# EAGLE schematic GD32F450 (EAGLE 9.6.2)
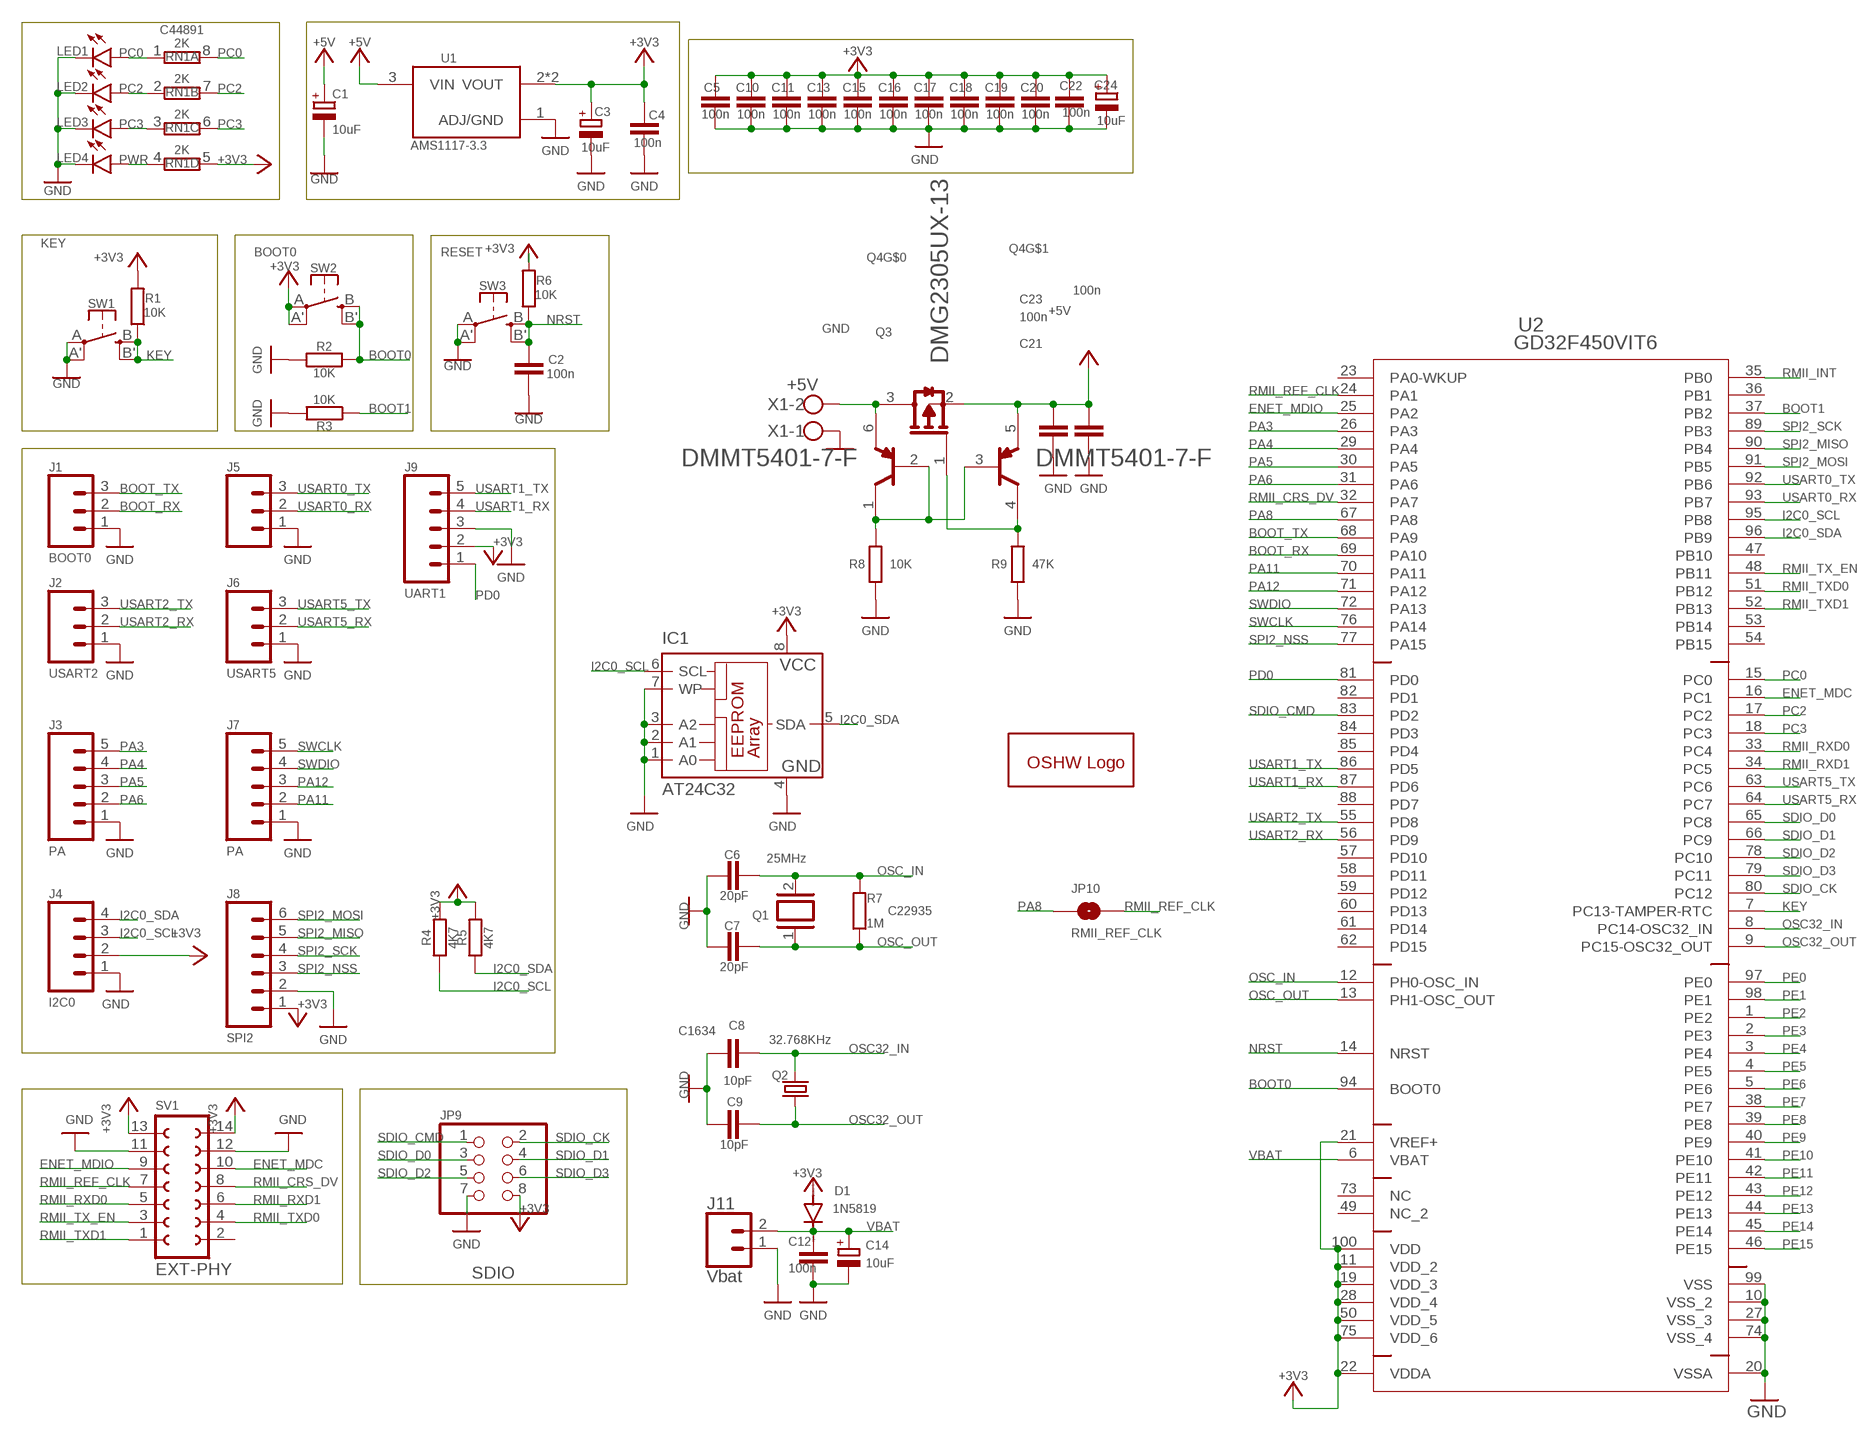
[diagram p0: schematic, sheet 1, part 1 of 2]
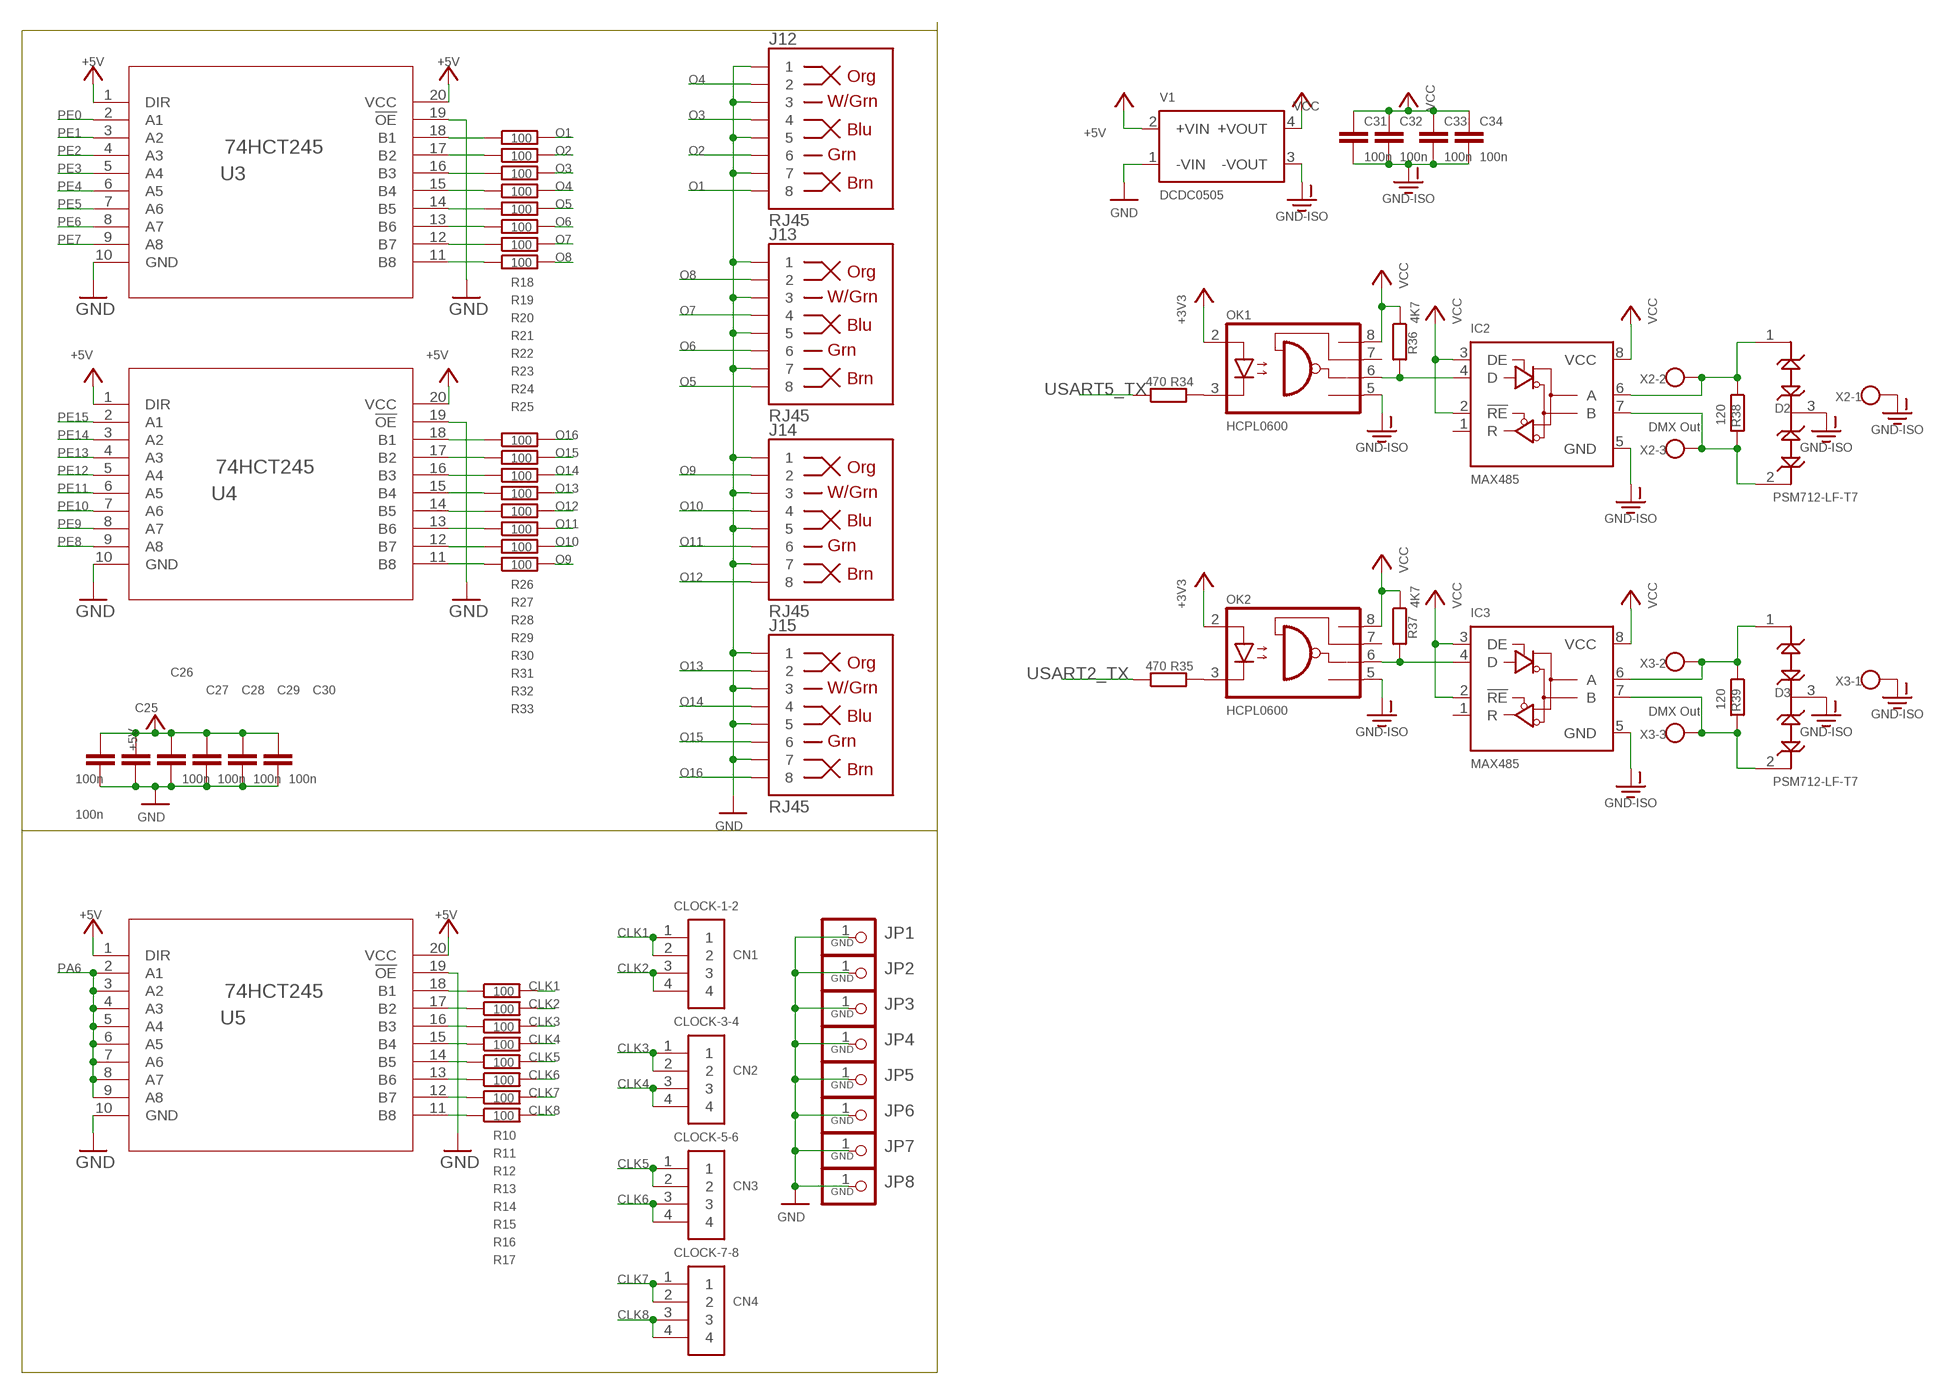
[diagram p1: schematic, sheet 1, part 2 of 2]

## Parts
C1  10uF  CPOL-EUA/3216-18R  [A/3216-18R]
C2  100n  C-EUC0603  [C0603]
C3  10uF  CPOL-EUA/3216-18R  [A/3216-18R]
C4  100n  C-EUC0603  [C0603]
C5  100n  C-EUC0603  [C0603]
C6  20pF  C-EUC0603  [C0603]
C7  20pF  C-EUC0603  [C0603]
C8  10pF  C-EUC0603  [C0603]
C9  10pF  C-EUC0603  [C0603]
C10  100n  C-EUC0603  [C0603]
C11  100n  C-EUC0603  [C0603]
C12  100n  C-EUC0603  [C0603]
C13  100n  C-EUC0603  [C0603]
C14  10uF  CPOL-EUA/3216-18R  [A/3216-18R]
C15  100n  C-EUC0603  [C0603]
C16  100n  C-EUC0603  [C0603]
C17  100n  C-EUC0603  [C0603]
C18  100n  C-EUC0603  [C0603]
C19  100n  C-EUC0603  [C0603]
C20  100n  C-EUC0603  [C0603]
C21  100n  C-EUC0603  [C0603]
C22  100n  C-EUC0603  [C0603]
C23  100n  C-EUC0603  [C0603]
C24  10uF  CPOL-EUA/3216-18R  [A/3216-18R]
C25  100n  C-EUC0603  [C0603]
C26  100n  C-EUC0603  [C0603]
C27  100n  C-EUC0603  [C0603]
C28  100n  C-EUC0603  [C0603]
C29  100n  C-EUC0603  [C0603]
C30  100n  C-EUC0603  [C0603]
C31  100n  C-EUC0603  [C0603]
C32  100n  C-EUC0603  [C0603]
C33  100n  C-EUC0603  [C0603]
C34  100n  C-EUC0603  [C0603]
CN1  CLOCK-1-2  1X4-CLEANBIG  [1X04-CLEANBIG]
CN2  CLOCK-3-4  1X4-CLEANBIG  [1X04-CLEANBIG]
CN3  CLOCK-5-6  1X4-CLEANBIG  [1X04-CLEANBIG]
CN4  CLOCK-7-8  1X4-CLEANBIG  [1X04-CLEANBIG]
D1  1N5819  DIODE-SOD323-R  [SOD323-R]
D2  PSM712-LF-T7  2CH_BI_DIR_TVSSOT23  [SOT23-3]
D3  PSM712-LF-T7  2CH_BI_DIR_TVSSOT23  [SOT23-3]
GOLD_ORB_SM1  OSHWLOGOLOGO5MM  [OSHW_5MM]
IC1  AT24C32  24C04ASM  [SO-08M]
IC2  MAX485  75176AD  [D_R-PDSO-G8]
IC3  MAX485  75176AD  [D_R-PDSO-G8]
J1  BOOT0  CONN_03  [1X03]
J2  USART2  CONN_03  [1X03]
J3  PA  CONN_05  [1X05]
J4  I2C0  CONN_04  [1X04]
J5  USART0  CONN_03  [1X03]
J6  USART5  CONN_03  [1X03]
J7  PA  CONN_05  [1X05]
J8  SPI2  CONN_06SILK_FEMALE_PTH  [1X06]
J9  UART1  CONN_05  [1X05]
J11  Vbat  CONN_021X02_NO_SILK  [1X02_NO_SILK]
J12  RJ45  RJ45-8  [RJ45-8]
J13  RJ45  RJ45-8  [RJ45-8]
J14  RJ45  RJ45-8  [RJ45-8]
J15  RJ45  RJ45-8  [RJ45-8]
JP1  GND  PINHD-1X1CB  [1X01-CLEANBIG]
JP2  GND  PINHD-1X1CB  [1X01-CLEANBIG]
JP3  GND  PINHD-1X1CB  [1X01-CLEANBIG]
JP4  GND  PINHD-1X1CB  [1X01-CLEANBIG]
JP5  GND  PINHD-1X1CB  [1X01-CLEANBIG]
JP6  GND  PINHD-1X1CB  [1X01-CLEANBIG]
JP7  GND  PINHD-1X1CB  [1X01-CLEANBIG]
JP8  GND  PINHD-1X1CB  [1X01-CLEANBIG]
JP9  SDIO  PINHD-2X4  [2X04]
JP10  RMII_REF_CLK  JUMPER-SMT_2_NO_NO-SILK  [SMT-JUMPER_2_NO_NO-SILK]
LED1  PC0  LEDCHIP-LED0603  [CHIP-LED0603]
LED2  PC2  LEDCHIP-LED0603  [CHIP-LED0603]
LED3  PC3  LEDCHIP-LED0603  [CHIP-LED0603]
LED4  PWR  LEDCHIP-LED0603  [CHIP-LED0603]
OK1  HCPL0600  [SOIC08]
OK2  HCPL0600  [SOIC08]
Q1  25MHz  XTAL/S  [QS]
Q2  32.768KHz  CRYSTALTC26H  [TC26H]
Q3  DMG2305UX  DIODES_INC._DMG2305UX-13DIODES_INC._DMG2305UX-13_0_0  [DIODES_INC._DMG2305UX-13_0]
Q4  DMMT5401  DIODES_DMMT5401-7-FDIODES_DMMT5401-7-F_0_0  [DIODES_DMMT5401-7-F_0]
R1  10K  R-EU_R0603  [R0603]
R2  10K  R-EU_R0603  [R0603]
R3  10K  R-EU_R0603  [R0603]
R4  4K7  R-EU_R0402  [R0402]
R5  4K7  R-EU_R0402  [R0402]
R6  10K  R-EU_R0603  [R0603]
R7  1M  R-EU_R0603  [R0603]
R8  10K  R-EU_R0402  [R0402]
R9  47K  R-EU_R0402  [R0402]
R10  100  R-EU_R0402  [R0402]
R11  100  R-EU_R0402  [R0402]
R12  100  R-EU_R0402  [R0402]
R13  100  R-EU_R0402  [R0402]
R14  100  R-EU_R0402  [R0402]
R15  100  R-EU_R0402  [R0402]
R16  100  R-EU_R0402  [R0402]
R17  100  R-EU_R0402  [R0402]
R18  100  R-EU_R0402  [R0402]
R19  100  R-EU_R0402  [R0402]
R20  100  R-EU_R0402  [R0402]
R21  100  R-EU_R0402  [R0402]
R22  100  R-EU_R0402  [R0402]
R23  100  R-EU_R0402  [R0402]
R24  100  R-EU_R0402  [R0402]
R25  100  R-EU_R0402  [R0402]
R26  100  R-EU_R0402  [R0402]
R27  100  R-EU_R0402  [R0402]
R28  100  R-EU_R0402  [R0402]
R29  100  R-EU_R0402  [R0402]
R30  100  R-EU_R0402  [R0402]
R31  100  R-EU_R0402  [R0402]
R32  100  R-EU_R0402  [R0402]
R33  100  R-EU_R0402  [R0402]
R34  470  R-EU_R0402  [R0402]
R35  470  R-EU_R0402  [R0402]
R36  4K7  R-EU_R0402  [R0402]
R37  4K7  R-EU_R0402  [R0402]
R38  120  R-EU_R0402  [R0402]
R39  120  R-EU_R0402  [R0402]
RN1  2K  4R-N0402ARV341  [4X0402ARV341]
SV1  EXT-PHY  FE07-2W  [FE07-2W]
SW1  KEY  SPST_TACT-EVQQ2  [EVQ-Q2]
SW2  BOOT0  SPST_TACT-EVQQ2  [EVQ-Q2]
SW3  RESET  SPST_TACT-EVQQ2  [EVQ-Q2]
U1  AMS1117-3.3  [SOT229P700X180-4N]
U2  GD32F450VIT6  GD32F450VET6  [LQFP100]
U3  74HCT245  SN74HCT245PWR  [PW20]
U4  74HCT245  SN74HCT245PWR  [PW20]
U5  74HCT245  SN74HCT245PWR  [PW20]
V1  DCDC0505  TME0505S  [TME]
X1  +5V  W237-102  [W237-102]
X2  DMX Out  W237-103  [W237-103]
X3  DMX Out  W237-103  [W237-103]

## Nets
+3V3: C3.+ C4.1 C5.1 C10.1 C11.1 C13.1 C15.1 C16.1 C17.1 C18.1 C19.1 C20.1 C22.1 C24.+ D1.A IC1.8(VCC) J4.2 J8.1 J9.2 JP9.8 OK1.2(A) OK2.2(A) R1.2 R4.2 R5.2 R6.2 RN1.5 SV1.13 SV1.14 SW2.A'(P1) SW2.A(P) U1.2(VOUT) U1.4(VOUT) U2.11(VDD_2) U2.19(VDD_3) U2.21(VREF+) U2.22(VDDA) U2.28(VDD_4) U2.50(VDD_5) U2.75(VDD_6) U2.100(VDD)
+5V: C1.+ C21.1 C23.1 C25.1 C26.1 C27.1 C28.1 C29.1 C30.1 Q3.2(S) Q4.5(E2) U1.3(VIN) U3.1(DIR) U3.20(VCC) U4.1(DIR) U4.20(VCC) U5.1(DIR) U5.20(VCC) V1.2(+VIN)
BOOT0: R2.2 SW2.B'(S1) SW2.B(S) U2.94(BOOT0)
BOOT1: R3.1 U2.37(PB2)
BOOT_RX: J1.2 U2.69(PA10)
BOOT_TX: J1.3 U2.68(PA9)
CLK1: CN1.1 CN1.2 R10.2
CLK2: CN1.3 CN1.4 R11.2
CLK3: CN2.1 CN2.2 R12.2
CLK4: CN2.3 CN2.4 R13.2
CLK5: CN3.1 CN3.2 R14.2
CLK6: CN3.3 CN3.4 R15.2
CLK7: CN4.1 CN4.2 R16.2
CLK8: CN4.3 CN4.4 R17.2
ENET_MDC: SV1.10 U2.16(PC1)
ENET_MDIO: SV1.9 U2.25(PA2)
GND: C1.- C2.2 C3.- C4.2 C5.2 C6.1 C7.1 C8.1 C9.1 C10.2 C11.2 C12.2 C13.2 C14.- C15.2 C16.2 C17.2 C18.2 C19.2 C20.2 C21.2 C22.2 C23.2 C24.- C25.2 C26.2 C27.2 C28.2 C29.2 C30.2 IC1.1(A0) IC1.2(A1) IC1.3(A2) IC1.4(GND) IC1.7(WP) J1.1 J2.1 J3.1 J4.1 J5.1 J6.1 J7.1 J8.2 J9.3 J11.1 J12.1 J12.3 J12.5 J12.7 J13.1 J13.3 J13.5 J13.7 J14.1 J14.3 J14.5 J14.7 J15.1 J15.3 J15.5 J15.7 JP1.1 JP2.1 JP3.1 JP4.1 JP5.1 JP6.1 JP7.1 JP8.1 JP9.7 LED1.C LED2.C LED3.C LED4.C R2.1 R3.2 R8.1 R9.1 SV1.11 SV1.12 SW1.A'(P1) SW1.A(P) SW3.A'(P1) SW3.A(P) U1.1(ADJ/GND) U2.10(VSS_2) U2.20(VSSA) U2.27(VSS_3) U2.74(VSS_4) U2.99(VSS) U3.10(GND) U3.19(!OE) U4.10(GND) U4.19(!OE) U5.10(GND) U5.19(!OE) V1.1(-VIN) X1.1
GND-ISO: C31.2 C32.2 C33.2 C34.2 D2.3 D3.3 IC2.5(GND) IC3.5(GND) OK1.5(GND) OK2.5(GND) V1.3(-VOUT) X2.1 X3.1
I2C0_SCL: IC1.6(SCL) J4.3 R4.1 U2.95(PB8)
I2C0_SDA: IC1.5(SDA) J4.4 R5.1 U2.96(PB9)
KEY: R1.1 SW1.B'(S1) SW1.B(S) U2.7(PC13-TAMPER-RTC)
N$1: R18.1 U3.18(B1)
N$2: Q4.1(C1) Q4.2(B1) Q4.3(B2) R8.2
N$3: R19.1 U3.17(B2)
N$4: R20.1 U3.16(B3)
N$5: R21.1 U3.15(B4)
N$6: R22.1 U3.14(B5)
N$7: R23.1 U3.13(B6)
N$8: R24.1 U3.12(B7)
N$9: R25.1 U3.11(B8)
N$10: LED1.A RN1.1
N$11: LED2.A RN1.2
N$12: R26.1 U4.18(B1)
N$13: R27.1 U4.17(B2)
N$14: R28.1 U4.16(B3)
N$15: R29.1 U4.15(B4)
N$16: R30.1 U4.14(B5)
N$17: R31.1 U4.13(B6)
N$18: R32.1 U4.12(B7)
N$19: R33.1 U4.11(B8)
N$20: IC2.4(D) OK1.6(VO) R36.2
N$21: OK1.3(C) R34.2
N$22: IC3.4(D) OK2.6(VO) R37.2
N$23: OK2.3(C) R35.2
N$24: D2.1 IC2.6(A) R38.1 X2.2
N$25: LED3.A RN1.3
N$26: LED4.A RN1.4
N$27: D2.2 IC2.7(B) R38.2 X2.3
N$28: D3.2 IC3.7(B) R39.2 X3.3
N$29: D3.1 IC3.6(A) R39.1 X3.2
N$30: Q3.1(G) Q4.4(C2) R9.2
N$31: Q3.3(D) Q4.6(E1) X1.2
N$33: R10.1 U5.18(B1)
N$34: R11.1 U5.17(B2)
N$35: R12.1 U5.16(B3)
N$36: R13.1 U5.15(B4)
N$37: R14.1 U5.14(B5)
N$38: R15.1 U5.13(B6)
N$39: R16.1 U5.12(B7)
N$40: R17.1 U5.11(B8)
NRST: C2.1 R6.1 SW3.B'(S1) SW3.B(S) U2.14(NRST)
O1: J12.8 R18.2
O2: J12.6 R19.2
O3: J12.4 R20.2
O4: J12.2 R21.2
O5: J13.8 R22.2
O6: J13.6 R23.2
O7: J13.4 R24.2
O8: J13.2 R25.2
O9: J14.2 R33.2
O10: J14.4 R32.2
O11: J14.6 R31.2
O12: J14.8 R30.2
O13: J15.2 R29.2
O14: J15.4 R28.2
O15: J15.6 R27.2
O16: J15.8 R26.2
OSC32_IN: C8.2 Q2.2 U2.8(PC14-OSC32_IN)
OSC32_OUT: C9.2 Q2.1 U2.9(PC15-OSC32_OUT)
OSC_IN: C6.2 Q1.2 R7.2 U2.12(PH0-OSC_IN)
OSC_OUT: C7.2 Q1.1 R7.1 U2.13(PH1-OSC_OUT)
PA3: J3.5 U2.26(PA3)
PA4: J3.4 U2.29(PA4)
PA5: J3.3 U2.30(PA5)
PA6: J3.2 U2.31(PA6) U5.2(A1) U5.3(A2) U5.4(A3) U5.5(A4) U5.6(A5) U5.7(A6) U5.8(A7) U5.9(A8)
PA8: JP10.1 U2.67(PA8)
PA11: J7.2 U2.70(PA11)
PA12: J7.3 U2.71(PA12)
PC0: RN1.8 U2.15(PC0)
PC2: RN1.7 U2.17(PC2)
PC3: RN1.6 U2.18(PC3)
PD0: J9.1 U2.81(PD0)
PE0: U2.97(PE0) U3.2(A1)
PE1: U2.98(PE1) U3.3(A2)
PE2: U2.1(PE2) U3.4(A3)
PE3: U2.2(PE3) U3.5(A4)
PE4: U2.3(PE4) U3.6(A5)
PE5: U2.4(PE5) U3.7(A6)
PE6: U2.5(PE6) U3.8(A7)
PE7: U2.38(PE7) U3.9(A8)
PE8: U2.39(PE8) U4.9(A8)
PE9: U2.40(PE9) U4.8(A7)
PE10: U2.41(PE10) U4.7(A6)
PE11: U2.42(PE11) U4.6(A5)
PE12: U2.43(PE12) U4.5(A4)
PE13: U2.44(PE13) U4.4(A3)
PE14: U2.45(PE14) U4.3(A2)
PE15: U2.46(PE15) U4.2(A1)
RMII_CRS_DV: SV1.8 U2.32(PA7)
RMII_INT: U2.35(PB0)
RMII_REF_CLK: JP10.2 SV1.7 U2.24(PA1)
RMII_RXD0: SV1.5 U2.33(PC4)
RMII_RXD1: SV1.6 U2.34(PC5)
RMII_TX_EN: SV1.3 U2.48(PB11)
RMII_TXD0: SV1.4 U2.51(PB12)
RMII_TXD1: SV1.1 U2.52(PB13)
SDIO_CK: JP9.2 U2.80(PC12)
SDIO_CMD: JP9.1 U2.83(PD2)
SDIO_D0: JP9.3 U2.65(PC8)
SDIO_D1: JP9.4 U2.66(PC9)
SDIO_D2: JP9.5 U2.78(PC10)
SDIO_D3: JP9.6 U2.79(PC11)
SPI2_MISO: J8.5 U2.90(PB4)
SPI2_MOSI: J8.6 U2.91(PB5)
SPI2_NSS: J8.3 U2.77(PA15)
SPI2_SCK: J8.4 U2.89(PB3)
SWCLK: J7.5 U2.76(PA14)
SWDIO: J7.4 U2.72(PA13)
USART0_RX: J5.2 U2.93(PB7)
USART0_TX: J5.3 U2.92(PB6)
USART1_RX: J9.4 U2.87(PD6)
USART1_TX: J9.5 U2.86(PD5)
USART2_RX: J2.2 U2.56(PD9)
USART2_TX: J2.3 R35.1 U2.55(PD8)
USART5_RX: J6.2 U2.64(PC7)
USART5_TX: J6.3 R34.1 U2.63(PC6)
VBAT: C12.1 C14.+ D1.C J11.2 U2.6(VBAT)
VCC: C31.1 C32.1 C33.1 C34.1 IC2.2(!RE) IC2.3(DE) IC2.8(VCC) IC3.2(!RE) IC3.3(DE) IC3.8(VCC) OK1.8(VCC) OK2.8(VCC) R36.1 R37.1 V1.4(+VOUT)
Unconnected: IC2.1(R) IC3.1(R) OK1.7(VE) OK2.7(VE) SV1.2 U2.23(PA0-WKUP) U2.36(PB1) U2.47(PB10) U2.49(NC_2) U2.53(PB14) U2.54(PB15) U2.57(PD10) U2.58(PD11) U2.59(PD12) U2.60(PD13) U2.61(PD14) U2.62(PD15) U2.73(NC) U2.82(PD1) U2.84(PD3) U2.85(PD4) U2.88(PD7)

## Library data of the parts
C1 C3 C14 C24 = rcl:CPOL-EU: POLARIZED CAPACITOR, European symbol; JLCPCB: C7171; SPICEPREFIX: C
C2 C4 C5 C10-C13 C15-C20 C22 C25-C34 = rcl:C-EU: CAPACITOR, European symbol; JLCPCB: C14663; SPICEPREFIX: C
C6 C7 = rcl:C-EU: CAPACITOR, European symbol; JLCPCB: C1648; SPICEPREFIX: C
C8 C9 = rcl:C-EU: CAPACITOR, European symbol; JLCPCB: C1634; SPICEPREFIX: C
C21 C23 = rcl:C-EU: CAPACITOR, European symbol; SPICEPREFIX: C
CN1-CN4 = adafruit:1X4: 4-pin connector
D1 = diode:DIODE-: DIODE; JLCPCB: C191023
D2 D3 = driver:2CH_BI_DIR_TVS: 2-Channel Bi-Directional TVS Array; JLCPCB: C32677
GOLD_ORB_SM1 = oshw:OSHWLOGO: The OSHW logo for PCB layout
IC1 = microchip:24*: Serial EEPROM I2C; MPN: M24C04-WMN6P; OC_FARNELL: 9882812; OC_NEWARK: 83K1376
IC2 IC3 = 751xx:75176A: DIFFERENTIAL BUS TRANSCEIVER Source: http://focus.ti.com/lit/ds/symlink/sn75176a.pdf; JLCPCB: C23492
J1 J2 J5 J6 = SparkFun-Connectors:CONN_03: Multi connection point. Often used as Generic Header-pin footprint for 0.1 inch spaced/style header connections On any of the 0.1 inch spaced packages, you can populate with these: Break Away Headers - Straight <https://www.sparkfun.com/products/116> (PRT-00116) Break Away Male Headers - Right Angle <https://www.sparkfun.com/products/553> (PRT-00553) Female Headers <https://www.sparkfun.com/products/115> (PRT-00115) Break Away Headers - Machine Pin <https://www.sparkfun.com/products/117> (PRT-00117) Break Away Female Headers - Swiss Machine Pin <https://www.sparkfun.com/products/743> (PRT-00743) Stackable Header - 3 Pin (Female, 0.1") <https://www.sparkfun.com/products/13875> (PRT-13875) For SCREWTERMINALS and SPRING TERMINALS visit here: Screw Terimnals on SparkFun.com <https://www.sparkfun.com/search/results?term=Screw+Terminals> (5mm/3.5mm/2.54mm spacing) This device is also useful as a general connection point to wire up your design to another part of your project. Our various solder wires solder well into these plated through hole pads. Hook-Up Wire - Assortment (Stranded, 22 AWG) <https://www.sparkfun.com/products/11375> (PRT-11375) Hook-Up Wire - Assortment (Solid Core, 22 AWG) <https://www.sparkfun.com/products/11367> (PRT-11367) View the entire wire category on our website here <https://www.sparkfun.com/categories/141> Special notes: Molex polarized connector foot print use with SKU : PRT-08232 with associated crimp pins and housings.
J3 J7 J9 = SparkFun-Connectors:CONN_05: Multi connection point. Often used as Generic Header-pin footprint for 0.1 inch spaced/style header connections On any of the 0.1 inch spaced packages, you can populate with these: Break Away Headers - Straight <https://www.sparkfun.com/products/116> (PRT-00116) Break Away Male Headers - Right Angle <https://www.sparkfun.com/products/553> (PRT-00553) Female Headers <https://www.sparkfun.com/products/115> (PRT-00115) Break Away Headers - Machine Pin <https://www.sparkfun.com/products/117> (PRT-00117) Break Away Female Headers - Swiss Machine Pin <https://www.sparkfun.com/products/743> (PRT-00743) For SCREWTERMINALS and SPRING TERMINALS visit here: Screw Terimnals on SparkFun.com <https://www.sparkfun.com/search/results?term=Screw+Terminals> (5mm/3.5mm/2.54mm spacing) This device is also useful as a general connection point to wire up your design to another part of your project. Our various solder wires solder well into these plated through hole pads. Hook-Up Wire - Assortment (Stranded, 22 AWG) <https://www.sparkfun.com/products/11375> (PRT-11375) Hook-Up Wire - Assortment (Solid Core, 22 AWG) <https://www.sparkfun.com/products/11367> (PRT-11367) View the entire wire category on our website here <https://www.sparkfun.com/categories/141> Special notes: Molex polarized connector foot print use with SKU : PRT-08231 with associated crimp pins and housings. 1MM SMD Version SKU: PRT-10208
J4 = SparkFun-Connectors:CONN_04: Multi connection point. Often used as Generic Header-pin footprint for 0.1 inch spaced/style header connections On any of the 0.1 inch spaced packages, you can populate with these: Break Away Headers - Straight <https://www.sparkfun.com/products/116> (PRT-00116) Break Away Male Headers - Right Angle <https://www.sparkfun.com/products/553> (PRT-00553) Female Headers <https://www.sparkfun.com/products/115> (PRT-00115) Break Away Headers - Machine Pin <https://www.sparkfun.com/products/117> (PRT-00117) Break Away Female Headers - Swiss Machine Pin <https://www.sparkfun.com/products/743> (PRT-00743) For SCREWTERMINALS and SPRING TERMINALS visit here: Screw Terimnals on SparkFun.com <https://www.sparkfun.com/search/results?term=Screw+Terminals> (5mm/3.5mm/2.54mm spacing) This device is also useful as a general connection point to wire up your design to another part of your project. Our various solder wires solder well into these plated through hole pads. Hook-Up Wire - Assortment (Stranded, 22 AWG) <https://www.sparkfun.com/products/11375> (PRT-11375) Hook-Up Wire - Assortment (Solid Core, 22 AWG) <https://www.sparkfun.com/products/11367> (PRT-11367) View the entire wire category on our website here <https://www.sparkfun.com/categories/141> Special notes: Molex polarized connector foot print use with SKU : PRT-08231 with associated crimp pins and housings. 1MM SMD Version SKU: PRT-10208; PROD_ID: CONN-09696
J8 = SparkFun-Connectors:CONN_06: Multi connection point. Often used as Generic Header-pin footprint for 0.1 inch spaced/style header connections On any of the 0.1 inch spaced packages, you can populate with these: Break Away Headers - Straight <https://www.sparkfun.com/products/116> (PRT-00116) Break Away Male Headers - Right Angle <https://www.sparkfun.com/products/553> (PRT-00553) Female Headers <https://www.sparkfun.com/products/115> (PRT-00115) Break Away Headers - Machine Pin <https://www.sparkfun.com/products/117> (PRT-00117) Break Away Female Headers - Swiss Machine Pin <https://www.sparkfun.com/products/743> (PRT-00743) Arduino Stackable Header - 6 Pin <https://www.sparkfun.com/products/9280> (PRT-09280) For SCREWTERMINALS and SPRING TERMINALS visit here: Screw Terimnals on SparkFun.com <https://www.sparkfun.com/search/results?term=Screw+Terminals> (5mm/3.5mm/2.54mm spacing) This device is also useful as a general connection point to wire up your design to another part of your project. Our various solder wires solder well into these plated through hole pads. Hook-Up Wire - Assortment (Stranded, 22 AWG) <https://www.sparkfun.com/products/11375> (PRT-11375) Hook-Up Wire - Assortment (Solid Core, 22 AWG) <https://www.sparkfun.com/products/11367> (PRT-11367) View the entire wire category on our website here <https://www.sparkfun.com/categories/141>; PROD_ID: CONN-08437
J11 = SparkFun-Connectors:CONN_02: Multi connection point. Often used as Generic Header-pin footprint for 0.1 inch spaced/style header connections On any of the 0.1 inch spaced packages, you can populate with these: Break Away Headers - Straight <https://www.sparkfun.com/products/116> (PRT-00116) Break Away Male Headers - Right Angle <https://www.sparkfun.com/products/553> (PRT-00553) Female Headers <https://www.sparkfun.com/products/115> (PRT-00115) Break Away Headers - Machine Pin <https://www.sparkfun.com/products/117> (PRT-00117) Break Away Female Headers - Swiss Machine Pin <https://www.sparkfun.com/products/743> (PRT-00743) For SCREWTERMINALS and SPRING TERMINALS visit here: Screw Terimnals on SparkFun.com <https://www.sparkfun.com/search/results?term=Screw+Terminals> (5mm/3.5mm/2.54mm spacing) This device is also useful as a general connection point to wire up your design to another part of your project. Our various solder wires solder well into these plated through hole pads. Hook-Up Wire - Assortment (Stranded, 22 AWG) <https://www.sparkfun.com/products/11375> (PRT-11375) Hook-Up Wire - Assortment (Solid Core, 22 AWG) <https://www.sparkfun.com/products/11367> (PRT-11367) View the entire wire category on our website here <https://www.sparkfun.com/categories/141> Special notes: Molex polarized connector foot print use with: PRT-08233 with associated crimp pins and housings. 2.54_SCREWTERM for use with PRT-10571. 3.5mm Screw Terminal footprints for PRT-08084 5mm Screw Terminal footprints for use with PRT-08432
J12-J15 = SparkFun-Connectors:RJ45-8: RJ45 Jack - 8 pin Simple RJ45, 8-pin connection. Commonly used for Cat5, Cat5e, and Cat6 Ethernet cables. Here is the connector we sell at SparkFun: RJ45 8-Pin Connector <https://www.sparkfun.com/products/643> (PRT-00643) Datasheet <https://cdn.sparkfun.com/datasheets/Prototyping/04908.pdf> It is used on this SparkFun product: SparkFun RJ45 Breakout <https://www.sparkfun.com/products/716> (BOB-00716) Note, you may also be interested in the "MAGJACK" version of this. It is basically a RJ45 connector, but also has some status LEDs built into the connector housing. You can check that out in this library at the device named "MAGJACK.dev" and see these products online: RJ45 Ethernet MagJack-Compatible <https://www.sparkfun.com/products/8534> (PRT-08534) SparkFun RJ45 MagJack Breakout <https://www.sparkfun.com/products/13021> (BOB-13021); PROD_ID: CONN-08506; SF_ID: PRT-00643
JP1-JP8 = adafruit:PINHD-1X1: Pin header 1x1 for 0.1" spacing With round pins
JP9 = pinhead:PINHD-2X4: PIN HEADER
JP10 = SparkFun-Jumpers:JUMPER-SMT_2_NO: Normally open jumper This jumper has two pads in close proximity to each other. Apply solder to close the connection. Round pads are easier to solder for beginners, but are a lot larger. SparkFun Product that uses the round pads: SparkFun EL Sequencer <https://www.sparkfun.com/products/12781>
LED1-LED4 = led:LED: LED OSRAM: - CHIPLED LG R971, LG N971, LY N971, LG Q971, LY Q971, LO R971, LY R971 LH N974, LH R974 LS Q976, LO Q976, LY Q976 LO Q996 - Hyper CHIPLED LW Q18S LB Q993, LB Q99A, LB R99A - SideLED LS A670, LO A670, LY A670, LG A670, LP A670 LB A673, LV A673, LT A673, LW A673 LH A674 LY A675 LS A676, LA A676, LO A676, LY A676, LW A676 LS A679, LY A679, LG A679 - Hyper Micro SIDELED® LS Y876, LA Y876, LO Y876, LY Y876 LT Y87S - SmartLED LW L88C, LW L88S LB L89C, LB L89S, LG L890 LS L89K, LO L89K, LY L89K LS L896, LA L896, LO L896, LY L896 - TOPLED LS T670, LO T670, LY T670, LG T670, LP T670 LSG T670, LSP T670, LSY T670, LOP T670, LYG T670 LG T671, LOG T671, LSG T671 LB T673, LV T673, LT T673, LW T673 LH T674 LS T676, LA T676, LO T676, LY T676, LB T676, LH T676, LSB T676, LW T676 LB T67C, LV T67C, LT T67C, LS T67K, LO T67K, LY T67K, LW E67C LS E67B, LA E67B, LO E67B, LY E67B, LB E67C, LV E67C, LT E67C LW T67C LS T679, LY T679, LG T679 LS T770, LO T770, LY T770, LG T770, LP T770 LB T773, LV T773, LT T773, LW T773 LH T774 LS E675, LA E675, LY E675, LS T675 LS T776, LA T776, LO T776, LY T776, LB T776 LHGB T686 LT T68C, LB T68C - Hyper Mini TOPLED® LB M676 - Mini TOPLED Santana® LG M470 LS M47K, LO M47K, LY M47K Source: http://www.osram.convergy.de LUXEON: - LUMILED® LXK2-PW12-R00, LXK2-PW12-S00, LXK2-PW14-U00, LXK2-PW14-V00 LXK2-PM12-R00, LXK2-PM12-S00, LXK2-PM14-U00 LXK2-PE12-Q00, LXK2-PE12-R00, LXK2-PE12-S00, LXK2-PE14-T00, LXK2-PE14-U00 LXK2-PB12-K00, LXK2-PB12-L00, LXK2-PB12-M00, LXK2-PB14-N00, LXK2-PB14-P00, LXK2-PB14-Q00 LXK2-PR12-L00, LXK2-PR12-M00, LXK2-PR14-Q00, LXK2-PR14-R00 LXK2-PD12-Q00, LXK2-PD12-R00, LXK2-PD12-S00 LXK2-PH12-R00, LXK2-PH12-S00 LXK2-PL12-P00, LXK2-PL12-Q00, LXK2-PL12-R00 Source: www.luxeon.com KINGBRIGHT: KA-3528ASYC Source: www.kingbright.com
OK1 OK2 = optocoupler:HCPL0600: HEWLETT PACKARD OPTO COUPLER; JLCPCB: C393524; MF: AGILENT TECHNOLOGIES; MPN: HCPL-0600-000E; OC_FARNELL: 9994696; OC_NEWARK: 88H7774
Q1 = special:XTAL/S: CRYSTAL
Q2 = crystal:CRYSTAL: CRYSTAL; OC_FARNELL: unknown; OC_NEWARK: unknown
Q3 = Diodes Inc. - DMG2305UX-13:DIODES_INC._DMG2305UX-13: P-Channel 20V 4.2A (Ta) 1.4W (Ta) Surface Mount SOT-23; AUTOMOTIVE: No; CENTROID_NOT_SPECIFIED: No; CONTINUOUS_DRAIN_CURRENT: -4.2A; DATASHEET: https://www.diodes.com/assets/Datasheets/DMG2305UX.pdf; DEPLETION_MODE: False; DEVICE_CLASS_L1: Discrete Semiconductors; DEVICE_CLASS_L2: Transistors; DEVICE_CLASS_L3: MOSFETs; DIGIKEY_DESCRIPTION: TRANS MOSFET P-CH 20V 4.2A SOT23; DIGIKEY_PART_NUMBER: DMG2305UX-13DICT-ND; DRAIN_TO_SOURCE_BREAKDOWN_VOLTAGE: -20V; DRAIN_TO_SOURCE_RESISTANCE: 40mΩ; DRAIN_TO_SOURCE_VOLTAGE: -20V; FOOTPRINT_PARAMETERS_1: {"fp_type":"SOT23","params":{"N":{"default":"3","long name":"Number of leads","type":"multichoice","short name":"N"},"A":{"nom":1024999,"long name":"Height","min":903000,"max":1100000,"short name":"A","type":"measurement"},"A1":{"nom":50000,"long name":"Package clearance","min":13000,"max":100000,"short name":"A1","type":"measurement"},"A2":{"nom":975000,"long name":"Package height","min":890000,"max":1000000,"short name":"A2","type":"measurement"},"D":{"nom":2900000,"long name":"Package length","min":2800000,"max":3000000,"short name":"D","type":"measurement"},"E":{"nom":2400000,"long name":"Width /w leads","min":2300000,"max":2500000,"short name":"E","type":"measurement"},"E1":{"nom":1300000,"long name":"Package width","min":1200000,"max":1400000,"short name":"E1","type":"measurement"},"B":{"nom":400000,"long name":"Lead width","min":370000,"max":510000,"short name":"B","type":"measurement"},"C":{"nom":110000,"long name":"Lead thickness","min":85000,"max":150000,"short name":"C","type":"measurement"},"L":{"nom":400000,"long name":"Lead foot length","min":250000,"max":550000,"short name":"L","type":"measurement"},"e":{"nom":915000,"long name":"Lead pitch","min":null,"max":null,"short name":"e","type":"measurement"},"PHI":{"nom":false,"long name":"Lead angle","min":0,"max":8000000,"short name":"PHI","type":"measurement"},"offset x":{"nom":0,"long name":"X Center offset","min":null,"max":null,"short name":"offset x","type":"measurement"},"offset y":{"nom":0,"long name":"Y Center offset","min":null,"max":null,"short name":"offset y","type":"measurement"},"LS":{"default":"Rounded rectangle","long name":"Land shape","type":"multichoice","short name":"LS"},"LS1":{"default":"Rectangle","long name":"Land shape (Pin 1)","type":"multichoice","short name":"LS1"},"solder toe":{"nom":550000,"long name":"Solder fillet (toe)","min":null,"max":null,"short name":"solder toe","type":"fixedmeasurement"},"solder heel":{"nom":450000,"long name":"Solder fillet (heel)","min":null,"max":null,"short name":"solder heel","type":"fixedmeasurement"},"solder side":{"nom":50000,"long name":"Solder fillet (side)","min":null,"max":null,"short name":"solder side","type":"fixedmeasurement"},"courtyard":{"nom":500000,"long name":"Courtyard","min":null,"max":null,"short name":"courtyard","type":"fixedmeasurement"},"SF":{"default":"A","long name":"Packing level","type":"multichoiceparent","short name":"SF","help":"http://support.upverter.com/customer/portal/articles/978783-what-is-a-footprint-packing-level","children":["solder toe","solder heel","solder side","courtyard"]}}}; FOOTPRINT_PARAMETERS_2: {"fp_type":"SOT23","params":{"N":{"default":"3","long name":"Number of leads","type":"multichoice","short name":"N"},"A":{"nom":1024999,"long name":"Height","min":903000,"max":1100000,"short name":"A","type":"measurement"},"A1":{"nom":50000,"long name":"Package clearance","min":13000,"max":100000,"short name":"A1","type":"measurement"},"A2":{"nom":975000,"long name":"Package height","min":890000,"max":1000000,"short name":"A2","type":"measurement"},"D":{"nom":2900000,"long name":"Package length","min":2800000,"max":3000000,"short name":"D","type":"measurement"},"E":{"nom":2400000,"long name":"Width /w leads","min":2300000,"max":2500000,"short name":"E","type":"measurement"},"E1":{"nom":1300000,"long name":"Package width","min":1200000,"max":1400000,"short name":"E1","type":"measurement"},"B":{"nom":400000,"long name":"Lead width","min":370000,"max":510000,"short name":"B","type":"measurement"},"C":{"nom":110000,"long name":"Lead thickness","min":85000,"max":150000,"short name":"C","type":"measurement"},"L":{"nom":400000,"long name":"Lead foot length","min":250000,"max":550000,"short name":"L","type":"measurement"},"e":{"nom":915000,"long name":"Lead pitch","min":null,"max":null,"short name":"e","type":"measurement"},"PHI":{"nom":false,"long name":"Lead angle","min":0,"max":8000000,"short name":"PHI","type":"measurement"},"offset x":{"nom":0,"long name":"X Center offset","min":null,"max":null,"short name":"offset x","type":"measurement"},"offset y":{"nom":0,"long name":"Y Center offset","min":null,"max":null,"short name":"offset y","type":"measurement"},"LS":{"default":"Rounded rectangle","long name":"Land shape","type":"multichoice","short name":"LS"},"LS1":{"default":"Rectangle","long name":"Land shape (Pin 1)","type":"multichoice","short name":"LS1"},"solder toe":{"nom":350000,"long name":"Solder fillet (toe)","min":null,"max":null,"short name":"solder toe","type":"fixedmeasurement"},"solder heel":{"nom":350000,"long name":"Solder fillet (heel)","min":null,"max":null,"short name":"solder heel","type":"fixedmeasurement"},"solder side":{"nom":30000,"long name":"Solder fillet (side)","min":null,"max":null,"short name":"solder side","type":"fixedmeasurement"},"courtyard":{"nom":250000,"long name":"Courtyard","min":null,"max":null,"short name":"courtyard","type":"fixedmeasurement"},"SF":{"default":"B","long name":"Packing level","type":"multichoiceparent","short name":"SF","help":"http://support.upverter.com/customer/portal/articles/978783-what-is-a-footprint-packing-level","children":["solder toe","solder heel","solder side","courtyard"]}}}; FOOTPRINT_PARAMETERS_3: {"fp_type":"SOT23","params":{"N":{"default":"3","long name":"Number of leads","type":"multichoice","short name":"N"},"A":{"nom":1024999,"long name":"Height","min":903000,"max":1100000,"short name":"A","type":"measurement"},"A1":{"nom":50000,"long name":"Package clearance","min":13000,"max":100000,"short name":"A1","type":"measurement"},"A2":{"nom":975000,"long name":"Package height","min":890000,"max":1000000,"short name":"A2","type":"measurement"},"D":{"nom":2900000,"long name":"Package length","min":2800000,"max":3000000,"short name":"D","type":"measurement"},"E":{"nom":2400000,"long name":"Width /w leads","min":2300000,"max":2500000,"short name":"E","type":"measurement"},"E1":{"nom":1300000,"long name":"Package width","min":1200000,"max":1400000,"short name":"E1","type":"measurement"},"B":{"nom":400000,"long name":"Lead width","min":370000,"max":510000,"short name":"B","type":"measurement"},"C":{"nom":110000,"long name":"Lead thickness","min":85000,"max":150000,"short name":"C","type":"measurement"},"L":{"nom":400000,"long name":"Lead foot length","min":250000,"max":550000,"short name":"L","type":"measurement"},"e":{"nom":915000,"long name":"Lead pitch","min":null,"max":null,"short name":"e","type":"measurement"},"PHI":{"nom":false,"long name":"Lead angle","min":0,"max":8000000,"short name":"PHI","type":"measurement"},"offset x":{"nom":0,"long name":"X Center offset","min":null,"max":null,"short name":"offset x","type":"measurement"},"offset y":{"nom":0,"long name":"Y Center offset","min":null,"max":null,"short name":"offset y","type":"measurement"},"LS":{"default":"Rounded rectangle","long name":"Land shape","type":"multichoice","short name":"LS"},"LS1":{"default":"Rectangle","long name":"Land shape (Pin 1)","type":"multichoice","short name":"LS1"},"solder toe":{"nom":150000,"long name":"Solder fillet (toe)","min":null,"max":null,"short name":"solder toe","type":"fixedmeasurement"},"solder heel":{"nom":250000,"long name":"Solder fillet (heel)","min":null,"max":null,"short name":"solder heel","type":"fixedmeasurement"},"solder side":{"nom":10000,"long name":"Solder fillet (side)","min":null,"max":null,"short name":"solder side","type":"fixedmeasurement"},"courtyard":{"nom":100000,"long name":"Courtyard","min":null,"max":null,"short name":"courtyard","type":"fixedmeasurement"},"SF":{"default":"C","long name":"Packing level","type":"multichoiceparent","short name":"SF","help":"http://support.upverter.com/customer/portal/articles/978783-what-is-a-footprint-packing-level","children":["solder toe","solder heel","solder side","courtyard"]}}}; FOOTPRINT_URL: https://www.diodes.com/assets/Package-Files/SOT23.pdf; FOOTPRINT_VARIANT_NAME_0: Recommended_Land_Pattern; FOOTPRINT_VARIANT_NAME_1: IPC_A; FOOTPRINT_VARIANT_NAME_2: IPC_B; FOOTPRINT_VARIANT_NAME_3: IPC_C; GATE_CHARGE_AT_VGS: 10.2nC @ -4.5V; GATE_TO_SOURCE_VOLTAGE: 8V; HEIGHT: 1.1mm; INPUT_CAPACITACE_AT_VDS: 808pF @ -15V; IPC_LAND_PATTERN_NAME: SOT92P240X102-3; LEAD_FREE: Yes; MAX_JUNCTION_TEMP: +150°C; MF: Diodes Inc.; MFG_PACKAGE_IDENT: SOT23; MFG_PACKAGE_IDENT_DATE: 01/2017; MFG_PACKAGE_IDENT_REV: 0; MOUSER_DESCRIPTION: MOSFET P-Ch ENH FET -20V 52mOhm -5.0V; MOUSER_PART_NUMBER: 621-DMG2305UX-13; MPN: DMG2305UX-13; NUMBER_OF_CHANNELS: 1; NUMBER_OF_P_CHANNELS: 1; PACKAGE: SOT23; POWER_DISSIPATION: 1.4W; PREFIX: Q; PULSE_DRAIN_CURRENT: -15A; ROHS: Yes; RTHJA_MAX: 90°C/W; STANDOFF_HEIGHT: 0.013mm; TEMPERATURE_RANGE_HIGH: +150°C; TEMPERATURE_RANGE_LOW: -55°C; THRESHOLD_VGS_MAX: -0.9V; THRESHOLD_VGS_MIN: -0.5V; TURN_OFF_DELAY_TIME: 79.3ns; TURN_ON_DELAY_TIME: 10.8ns; VERIFICATION_VERSION: 0.0.0.3
Q4 = Diodes - DMMT5401-7-F:DIODES_DMMT5401-7-F: Bipolar (BJT) Transistor Array 2 PNP (Dual) Matched Pair 150V 200mA 300MHz 300mW Surface Mount SOT-26; AUTOMOTIVE: Yes; AUTOMOTIVE_GRADE: Grade 0; CENTROID_NOT_SPECIFIED: No; CIIVA_IDS: 854262; COLLECTOR_BASE_VOLTAGE: -160V; COLLECTOR_EMITTER_BREAKDOWN_VOLTAGE: -150V; COLLECTOR_EMITTER_SATURATION_VOLTAGE: -0.5V; COLLECTOR_EMITTER_VOLTAGE: -150V; DATASHEET: https://www.diodes.com/assets/Datasheets/ds30437.pdf; DEVICE_CLASS_L1: Discrete Semiconductors; DEVICE_CLASS_L2: Transistors; DEVICE_CLASS_L3: BJTs; DIGIKEY_DESCRIPTION: TRANS 2PNP 150V 0.2A SOT26; DIGIKEY_PART_NUMBER: DMMT5401-FDICT-ND; EMITTER_BASE_VOLTAGE: -5V; FOOTPRINT_PARAMETERS_1: {"fp_type":"SOT23","params":{"N":{"default":"6","long name":"Number of leads","type":"multichoice","short name":"N"},"A":{"nom":1150000,"long name":"Height","min":1012999,"max":1400000,"short name":"A","type":"measurement"},"A1":{"nom":50000,"long name":"Package clearance","min":13000,"max":100000,"short name":"A1","type":"measurement"},"A2":{"nom":1100000,"long name":"Package height","min":1000000,"max":1300000,"short name":"A2","type":"measurement"},"D":{"nom":3000000,"long name":"Package length","min":2900000,"max":3100000,"short name":"D","type":"measurement"},"E":{"nom":2800000,"long name":"Width /w leads","min":2700000,"max":3000000,"short name":"E","type":"measurement"},"E1":{"nom":1600000,"long name":"Package width","min":1500000,"max":1700000,"short name":"E1","type":"measurement"},"B":{"nom":380000,"long name":"Lead width","min":350000,"max":500000,"short name":"B","type":"measurement"},"C":{"nom":150000,"long name":"Lead thickness","min":100000,"max":200000,"short name":"C","type":"measurement"},"L":{"nom":400000,"long name":"Lead foot length","min":350000,"max":550000,"short name":"L","type":"measurement"},"e":{"nom":950000,"long name":"Lead pitch","min":null,"max":null,"short name":"e","type":"measurement"},"PHI":{"nom":false,"long name":"Lead angle","min":0,"max":8000000,"short name":"PHI","type":"measurement"},"offset x":{"nom":0,"long name":"X Center offset","min":null,"max":null,"short name":"offset x","type":"measurement"},"offset y":{"nom":0,"long name":"Y Center offset","min":null,"max":null,"short name":"offset y","type":"measurement"},"LS":{"default":"Rounded rectangle","long name":"Land shape","type":"multichoice","short name":"LS"},"LS1":{"default":"Rectangle","long name":"Land shape (Pin 1)","type":"multichoice","short name":"LS1"},"solder toe":{"nom":550000,"long name":"Solder fillet (toe)","min":null,"max":null,"short name":"solder toe","type":"fixedmeasurement"},"solder heel":{"nom":450000,"long name":"Solder fillet (heel)","min":null,"max":null,"short name":"solder heel","type":"fixedmeasurement"},"solder side":{"nom":50000,"long name":"Solder fillet (side)","min":null,"max":null,"short name":"solder side","type":"fixedmeasurement"},"courtyard":{"nom":500000,"long name":"Courtyard","min":null,"max":null,"short name":"courtyard","type":"fixedmeasurement"},"SF":{"default":"A","long name":"Packing level","type":"multichoiceparent","short name":"SF","help":"http://support.upverter.com/customer/portal/articles/978783-what-is-a-footprint-packing-level","children":["solder toe","solder heel","solder side","courtyard"]}}}; FOOTPRINT_PARAMETERS_2: {"fp_type":"SOT23","params":{"N":{"default":"6","long name":"Number of leads","type":"multichoice","short name":"N"},"A":{"nom":1150000,"long name":"Height","min":1012999,"max":1400000,"short name":"A","type":"measurement"},"A1":{"nom":50000,"long name":"Package clearance","min":13000,"max":100000,"short name":"A1","type":"measurement"},"A2":{"nom":1100000,"long name":"Package height","min":1000000,"max":1300000,"short name":"A2","type":"measurement"},"D":{"nom":3000000,"long name":"Package length","min":2900000,"max":3100000,"short name":"D","type":"measurement"},"E":{"nom":2800000,"long name":"Width /w leads","min":2700000,"max":3000000,"short name":"E","type":"measurement"},"E1":{"nom":1600000,"long name":"Package width","min":1500000,"max":1700000,"short name":"E1","type":"measurement"},"B":{"nom":380000,"long name":"Lead width","min":350000,"max":500000,"short name":"B","type":"measurement"},"C":{"nom":150000,"long name":"Lead thickness","min":100000,"max":200000,"short name":"C","type":"measurement"},"L":{"nom":400000,"long name":"Lead foot length","min":350000,"max":550000,"short name":"L","type":"measurement"},"e":{"nom":950000,"long name":"Lead pitch","min":null,"max":null,"short name":"e","type":"measurement"},"PHI":{"nom":false,"long name":"Lead angle","min":0,"max":8000000,"short name":"PHI","type":"measurement"},"offset x":{"nom":0,"long name":"X Center offset","min":null,"max":null,"short name":"offset x","type":"measurement"},"offset y":{"nom":0,"long name":"Y Center offset","min":null,"max":null,"short name":"offset y","type":"measurement"},"LS":{"default":"Rounded rectangle","long name":"Land shape","type":"multichoice","short name":"LS"},"LS1":{"default":"Rectangle","long name":"Land shape (Pin 1)","type":"multichoice","short name":"LS1"},"solder toe":{"nom":350000,"long name":"Solder fillet (toe)","min":null,"max":null,"short name":"solder toe","type":"fixedmeasurement"},"solder heel":{"nom":350000,"long name":"Solder fillet (heel)","min":null,"max":null,"short name":"solder heel","type":"fixedmeasurement"},"solder side":{"nom":30000,"long name":"Solder fillet (side)","min":null,"max":null,"short name":"solder side","type":"fixedmeasurement"},"courtyard":{"nom":250000,"long name":"Courtyard","min":null,"max":null,"short name":"courtyard","type":"fixedmeasurement"},"SF":{"default":"B","long name":"Packing level","type":"multichoiceparent","short name":"SF","help":"http://support.upverter.com/customer/portal/articles/978783-what-is-a-footprint-packing-level","children":["solder toe","solder heel","solder side","courtyard"]}}}; FOOTPRINT_PARAMETERS_3: {"fp_type":"SOT23","params":{"N":{"default":"6","long name":"Number of leads","type":"multichoice","short name":"N"},"A":{"nom":1150000,"long name":"Height","min":1012999,"max":1400000,"short name":"A","type":"measurement"},"A1":{"nom":50000,"long name":"Package clearance","min":13000,"max":100000,"short name":"A1","type":"measurement"},"A2":{"nom":1100000,"long name":"Package height","min":1000000,"max":1300000,"short name":"A2","type":"measurement"},"D":{"nom":3000000,"long name":"Package length","min":2900000,"max":3100000,"short name":"D","type":"measurement"},"E":{"nom":2800000,"long name":"Width /w leads","min":2700000,"max":3000000,"short name":"E","type":"measurement"},"E1":{"nom":1600000,"long name":"Package width","min":1500000,"max":1700000,"short name":"E1","type":"measurement"},"B":{"nom":380000,"long name":"Lead width","min":350000,"max":500000,"short name":"B","type":"measurement"},"C":{"nom":150000,"long name":"Lead thickness","min":100000,"max":200000,"short name":"C","type":"measurement"},"L":{"nom":400000,"long name":"Lead foot length","min":350000,"max":550000,"short name":"L","type":"measurement"},"e":{"nom":950000,"long name":"Lead pitch","min":null,"max":null,"short name":"e","type":"measurement"},"PHI":{"nom":false,"long name":"Lead angle","min":0,"max":8000000,"short name":"PHI","type":"measurement"},"offset x":{"nom":0,"long name":"X Center offset","min":null,"max":null,"short name":"offset x","type":"measurement"},"offset y":{"nom":0,"long name":"Y Center offset","min":null,"max":null,"short name":"offset y","type":"measurement"},"LS":{"default":"Rounded rectangle","long name":"Land shape","type":"multichoice","short name":"LS"},"LS1":{"default":"Rectangle","long name":"Land shape (Pin 1)","type":"multichoice","short name":"LS1"},"solder toe":{"nom":150000,"long name":"Solder fillet (toe)","min":null,"max":null,"short name":"solder toe","type":"fixedmeasurement"},"solder heel":{"nom":250000,"long name":"Solder fillet (heel)","min":null,"max":null,"short name":"solder heel","type":"fixedmeasurement"},"solder side":{"nom":10000,"long name":"Solder fillet (side)","min":null,"max":null,"short name":"solder side","type":"fixedmeasurement"},"courtyard":{"nom":100000,"long name":"Courtyard","min":null,"max":null,"short name":"courtyard","type":"fixedmeasurement"},"SF":{"default":"C","long name":"Packing level","type":"multichoiceparent","short name":"SF","help":"http://support.upverter.com/customer/portal/articles/978783-what-is-a-footprint-packing-level","children":["solder toe","solder heel","solder side","courtyard"]}}}; FOOTPRINT_URL: https://www.diodes.com/assets/Package-Files/SOT26-SC74R.pdf; FOOTPRINT_VARIANT_NAME_0: Recommended_Land_Pattern; FOOTPRINT_VARIANT_NAME_1: IPC_A; FOOTPRINT_VARIANT_NAME_2: IPC_B; FOOTPRINT_VARIANT_NAME_3: IPC_C; GAIN_BANDWIDTH_PRODUCT: 100MHz; HEIGHT: 1.4mm; HFE_MAX: 240; HFE_MIN: 60; HFE_SS_MAX: 260; HFE_SS_MIN: 40; HFE_SS_TESTIC: -1mA; HFE_SS_TESTVCE: -10V; HFE_TESTIC: -10mA; HFE_TESTVCE: -5V; IMPORTED_FROM: vault; IMPORT_TS: 1521857859; LEAD_FREE: Yes; MAX_COLLECTOR_CURRENT: -200mA; MAX_JUNCTION_TEMP: +150°C; MF: Diodes; MFG_PACKAGE_IDENT: SOT26 (SC74R); MFG_PACKAGE_IDENT_COMPONENT_ID: 5f0f242ef940d63b; MFG_PACKAGE_IDENT_DATE: 03/2017; MFG_PACKAGE_IDENT_REV: 0; MOUSER_DESCRIPTION: Bipolar Transistors - BJT MATCHED PNP SM SIGNAL TRANS; MOUSER_PART_NUMBER: 621-DMMT5401-7-F; MPN: DMMT5401-7-F; NUMBER_OF_ELEMENTS: 2; NUMBER_OF_PNP: 2; PACKAGE: SOT-26-6; POWER_DISSIPATION: 300mW; PREFIX: Q; RELEASE_DATE: 1475030218; RESISTANCE: 56.2 kohm; ROHS: Yes; RTHJA_MAX: 417°C/W; STANDOFF_HEIGHT: 0.013mm; TEMPERATURE_RANGE_HIGH: +150°C; TEMPERATURE_RANGE_LOW: -55°C; VAULT_GUID: AAD9F767-3884-4A64-86E0-FF641185CA98; VERIFICATION_VERSION: 0.0.0.3
R1-R3 R6 = rcl:R-EU_: RESISTOR, European symbol; JLCPCB: C25804; SPICEPREFIX: R
R4 R5 = rcl:R-EU_: RESISTOR, European symbol; JLCPCB: C23162; SPICEPREFIX: R
R7 = rcl:R-EU_: RESISTOR, European symbol; JLCPCB: C22935; SPICEPREFIX: R
R8-R33 = rcl:R-EU_: RESISTOR, European symbol; SPICEPREFIX: R
R34 R35 = rcl:R-EU_: RESISTOR, European symbol; JLCPCB: C25117; SPICEPREFIX: R
R36 R37 = rcl:R-EU_: RESISTOR, European symbol; JLCPCB: C275348; SPICEPREFIX: R
R38 R39 = rcl:R-EU_: RESISTOR, European symbol; JLCPCB: C25079; SPICEPREFIX: R
RN1 = resistor-dil:4R-N: Array Chip Resistor Source: RS Component / Phycomp; JLCPCB: C44891; OC_FARNELL: unknown; OC_NEWARK: unknown
SV1 = con-lsta:FE07-2W: FEMALE HEADER; OC_FARNELL: unknown; OC_NEWARK: unknown
SW1 SW3 = adafruit:SPST_TACT: SMT 6mm switch, EVQQ2 series http://www.ladyada.net/library/eagle
SW2 = adafruit:SPST_TACT: SMT 6mm switch, EVQQ2 series http://www.ladyada.net/library/eagle; JLCPCB: C221880
U1 = AMS1117-3.3:AMS1117-3.3: Fixed 15V 3.3V 1.3V @ 800mA SOT-223 Dropout Regulators(LDO); DESCRIPTION: Fixed 15V 3.3V 1.3V @ 800mA SOT-223 Dropout Regulators(LDO) RoHS; JLCPCB_PART_NUMBER: C6186; MF: Advanced Monolithic Systems; MP: AMS1117-3.3; PACKAGE: SOT-223
U2 = GD32F450Vx:GD32F450VET6; COPYRIGHT: Copyright (C) 2022 Ultra Librarian. All rights reserved.; MANUFACTURER_PART_NUMBER: GD32F450VET6; MFR_NAME: GigaDevice
U3-U5 = SN74HCT245PWR:SN74HCT245PWR; DATASHEET_URL: http://www.ti.com/lit/gpn/SN74HCT245; DESCRIPTION: Octal Bus Transceivers With 3-State Outputs; FAMILY_NAME: STANDARD TRANSCEIVER; GENERIC_PART_NUMBER: SN74HCT245; INDUSTRY_STD_PKG_TYPE: TSSOP; MANUFACTURER: Texas Instruments; MANUFACTURER_PART_NUMBER: SN74HCT245PWR; PACKAGE_DESIGNATOR: PW; PIN_COUNT: 20; VENDOR: Texas Instruments
V1 = traco-electronic:TME?*: DC/DC Converter TME Series 1 Watt Source: www.tracopower.com .. tme.pdf; MPN: TME 0505S; OC_FARNELL: 1007538; OC_NEWARK: 51R5321
X1 = con-wago-500:W237-102: WAGO SCREW CLAMP; MPN: 237-102; OC_FARNELL: unknown; OC_NEWARK: 70K9898
X2 X3 = con-wago-500:W237-103: WAGO SCREW CLAMP; MPN: 237-103; OC_FARNELL: unknown; OC_NEWARK: 18M7116